# EAGLE schematic schematics (EAGLE 6.6.0)
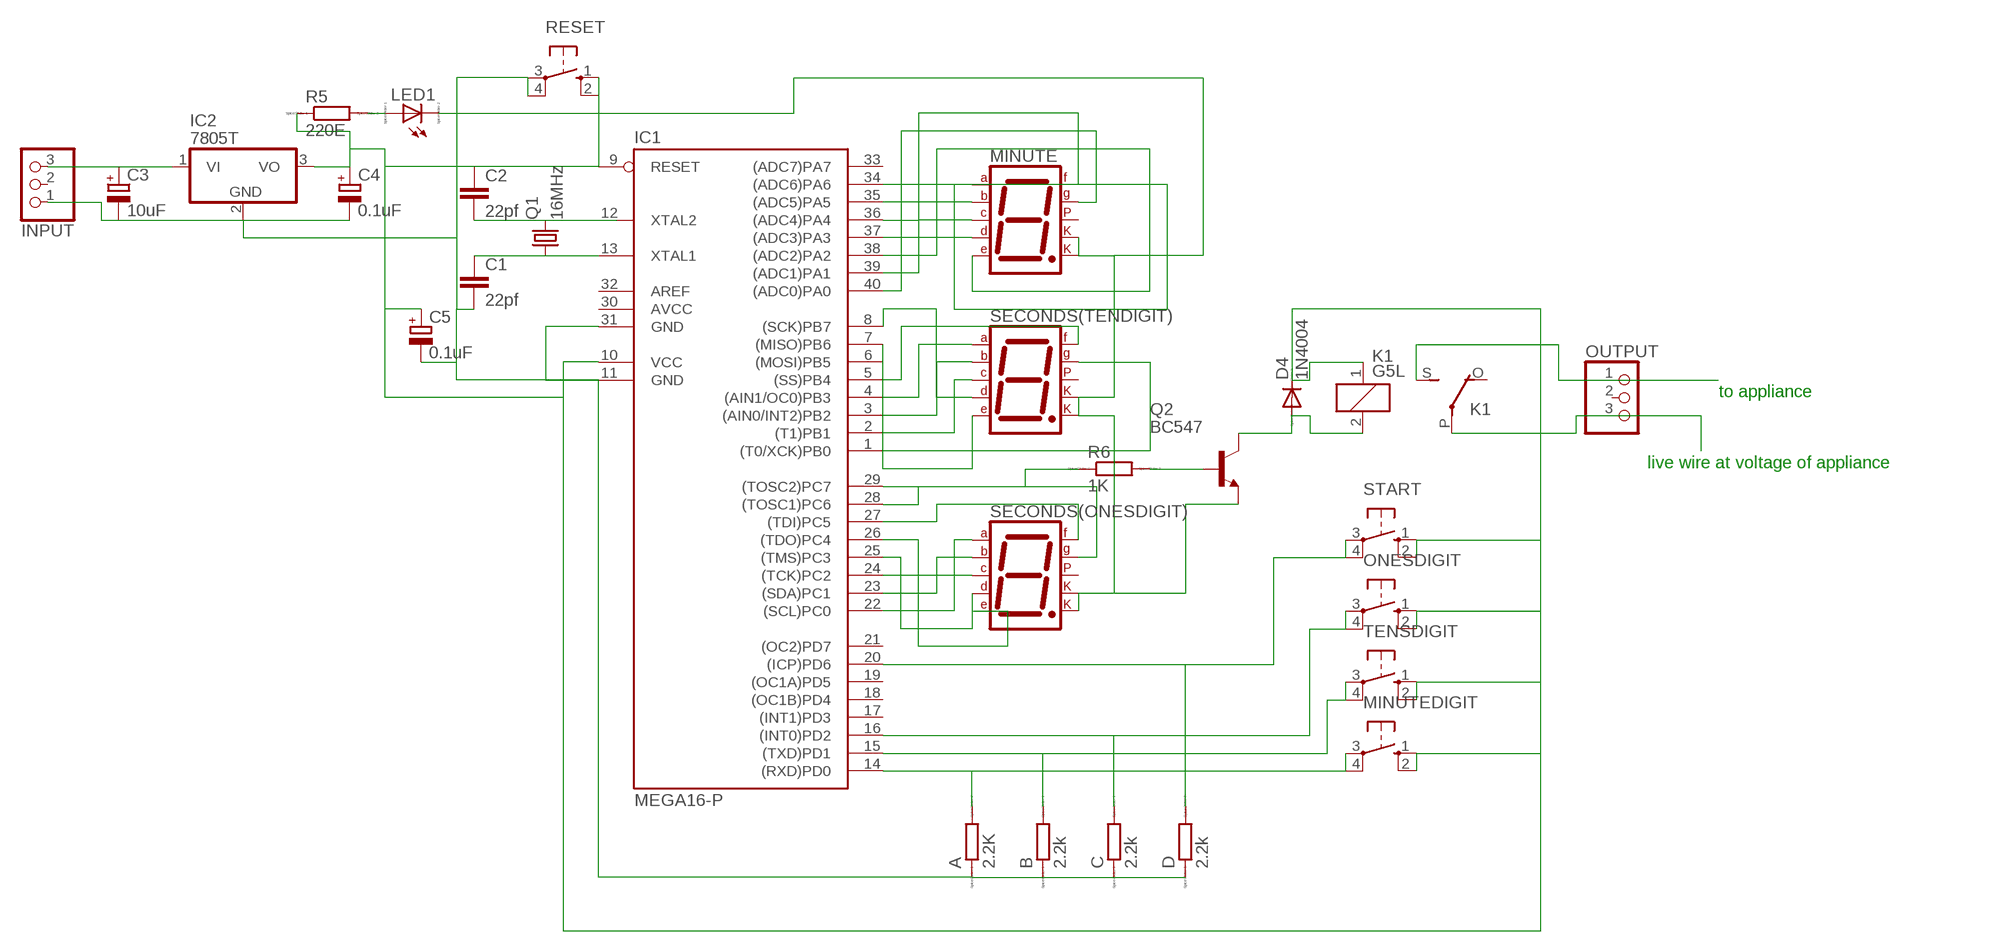
[diagram p0: schematic, sheet 1]

## Parts
A  2.2K  R0204/7  [0204/7]
B  2.2k  R0204/7  [0204/7]
C  2.2k  R0204/7  [0204/7]
C1  22pf  C-EU025-030X050  [C025-030X050]
C2  22pf  C-EU025-030X050  [C025-030X050]
C3  10uF  CPOL-EUE5-6  [E5-6]
C4  0.1uF  CPOL-EUE5-6  [E5-6]
C5  0.1uF  CPOL-EUE5-6  [E5-6]
D  2.2k  R0204/7  [0204/7]
D4  1N4004  [DO41-10]
IC1  MEGA16-P  [DIL40]
IC2  7805T  [TO220H]
INPUT  PINHD-1X3  [1X03]
K1  G5L  [G5LE]
LED1  LED_ELD260  [LED_LD260]
MINUTE  7SEG-CK  [7SEG-13]
MINUTEDIGIT  10-XX  [B3F-10XX]
ONESDIGIT  10-XX  [B3F-10XX]
OUTPUT  PINHD-1X3  [1X03]
Q1  16MHz  CRYSTALHC49S  [HC49/S]
Q2  BC547  [TO92]
R5  220E  R0204/7  [0204/7]
R6  1K  R0204/7  [0204/7]
RESET  10-XX  [B3F-10XX]
SECONDS(ONESDIGIT)  7SEG-CK  [7SEG-13]
SECONDS(TENDIGIT)  7SEG-CK  [7SEG-13]
START  10-XX  [B3F-10XX]
TENSDIGIT  10-XX  [B3F-10XX]

## Nets
INPUT: A.1 B.1 C1.2 C2.1 C3.- C4.- C5.- C.1 D.1 IC1.11(GND) IC1.31(GND) IC2.2(GND) INPUT.1 LED1.K(C) MINUTE.3(CK1) MINUTE.8(CK2) Q2.1(E) RESET.3(P) RESET.4(P1) SECONDS(ONESDIGIT).3(CK1) SECONDS(ONESDIGIT).8(CK2) SECONDS(TENDIGIT).3(CK1) SECONDS(TENDIGIT).8(CK2)
N$1: C3.+ IC2.1(VI) INPUT.3
N$2: K1.P(2:P) OUTPUT.3
N$3: K1.S(2:S) OUTPUT.1
N$4: C2.2 Q1.2
N$5: C1.1 IC1.13(XTAL1) Q1.1
N$6: IC1.1((T0/XCK)PB0) SECONDS(TENDIGIT).10(G)
N$7: IC1.34((ADC6)PA6) MINUTE.2(D)
N$8: LED1.A R5.2
N$9: IC1.40((ADC0)PA0) MINUTE.10(G)
N$10: IC1.39((ADC1)PA1) MINUTE.4(C)
N$11: IC1.35((ADC5)PA5) IC1.38((ADC2)PA2) MINUTE.1(E) MINUTE.6(B)
N$12: IC1.37((ADC3)PA3) MINUTE.7(A)
N$13: IC1.36((ADC4)PA4) MINUTE.9(F)
N$14: IC1.2((T1)PB1) SECONDS(TENDIGIT).4(C)
N$15: IC1.3((AIN0/INT2)PB2) SECONDS(TENDIGIT).6(B)
N$16: IC1.4((AIN1/OC0)PB3) SECONDS(TENDIGIT).7(A)
N$17: IC1.5((SS)PB4) SECONDS(TENDIGIT).9(F)
N$18: IC1.7((MISO)PB6) SECONDS(TENDIGIT).1(E)
N$19: IC1.8((SCK)PB7) SECONDS(TENDIGIT).2(D)
N$20: IC1.22((SCL)PC0) SECONDS(ONESDIGIT).7(A)
N$21: IC1.23((SDA)PC1) SECONDS(ONESDIGIT).6(B)
N$22: IC1.24((TCK)PC2) SECONDS(ONESDIGIT).4(C)
N$23: IC1.25((TMS)PC3) IC1.26((TDO)PC4) SECONDS(ONESDIGIT).2(D)
N$24: IC1.27((TDI)PC5) SECONDS(ONESDIGIT).9(F)
N$25: IC1.28((TOSC1)PC6) SECONDS(ONESDIGIT).10(G)
N$26: IC1.29((TOSC2)PC7) R6.1
N$29: D4.A K1.2 Q2.3(C)
N$32: Q2.2(B) R6.2
N$35: D.2 IC1.20((ICP)PD6) START.3(P) START.4(P1)
N$36: C.2 IC1.16((INT0)PD2) ONESDIGIT.3(P) ONESDIGIT.4(P1)
N$37: B.2 IC1.15((TXD)PD1) TENSDIGIT.3(P) TENSDIGIT.4(P1)
N$38: A.2 IC1.14((RXD)PD0) MINUTEDIGIT.3(P) MINUTEDIGIT.4(P1)
N$44: C4.+ C5.+ D4.C IC1.9(RESET) IC1.10(VCC) IC2.3(VO) K1.1 MINUTEDIGIT.1(S) MINUTEDIGIT.2(S1) ONESDIGIT.1(S) ONESDIGIT.2(S1) R5.1 RESET.1(S) RESET.2(S1) START.1(S) START.2(S1) TENSDIGIT.1(S) TENSDIGIT.2(S1)
Unconnected: IC1.6((MOSI)PB5) IC1.12(XTAL2) IC1.17((INT1)PD3) IC1.18((OC1B)PD4) IC1.19((OC1A)PD5) IC1.21((OC2)PD7) IC1.32(AREF) IC1.33((ADC7)PA7) INPUT.2 K1.O(2:O) MINUTE.5(DP) OUTPUT.2 SECONDS(ONESDIGIT).1(E) SECONDS(ONESDIGIT).5(DP) SECONDS(TENDIGIT).5(DP)

## Notes on the sheet
- to appliance
- live wire at voltage of appliance

## Power pins joined to a net without a drawn wire
AVCC: IC1.30(AVCC)

## Library data of the parts
A B C D R5 R6 = eagle-ltspice:R: RESISTOR, European symbol; SPICEMODEL: NONE; SPICEPREFIX: R
C1 C2 = rcl:C-EU: CAPACITOR, European symbol
C3-C5 = rcl:CPOL-EU: POLARIZED CAPACITOR, European symbol
D4 = diode:1N4004: DIODE general purpose rectifier, 1 A
IC1 = atmel:MEGA16-P: MICROCONTROLLER 16 Kbytes FLASH 1 kbytes SRAM 512 bytes EEPROM USART 8-channel 10 bit ADC Source: avr.lbr; MPN: ATMEGA16-16PU; OC_FARNELL: 9171142; OC_NEWARK: 01M6885
IC2 = linear:78*: Positive VOLTAGE REGULATOR Source: http://cache.national.com/ds/LM/LM78L05.pdf http://www.fairchildsemi.com/ds/LM/LM7805.pdf
INPUT OUTPUT = pinhead:PINHD-1X3: PIN HEADER
K1 = relay:G5L: RELAY 1 x switch, 10 A/120 V AC, 8 A/30 V ADC, Omron; OC_FARNELL: unknown; OC_NEWARK: unknown
LED1 = eagle-ltspice:LED_E: LED Source: http://www.osram.convergy.de Source: www.luxeon.com Source: www.kingbright.com; SPICEMODEL: NONE; SPICEPREFIX: D; SPICETYPE: diode
MINUTE SECONDS(ONESDIGIT) SECONDS(TENDIGIT) = special:7SEG-CK: 7-segment DISPLAY single cathode, 13 mm
MINUTEDIGIT ONESDIGIT RESET START TENSDIGIT = switch-omron:10-XX: OMRON SWITCH; MPN: B3F-1000; OC_FARNELL: 176432; OC_NEWARK: 36M3542
Q1 = crystal:CRYSTAL: CRYSTAL; OC_FARNELL: 1667008; OC_NEWARK: unknown
Q2 = transistor-npn:BC547*: NPN Transistor